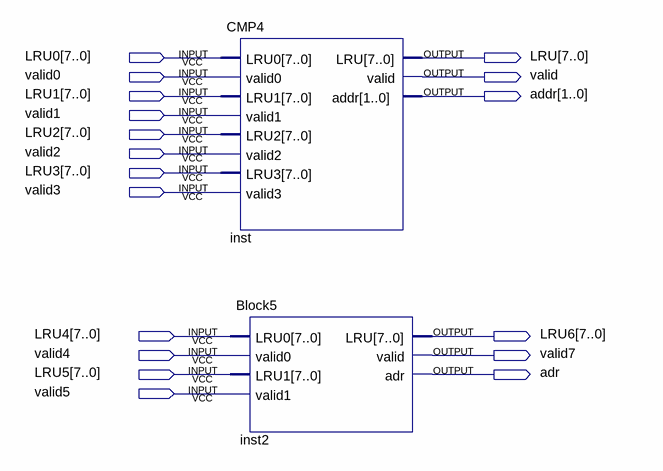
[diagram p0: schematic sheet]
// Quartus schematic CMP4test.bdf as structural Verilog: 2 symbols, 18 pins
module CMP4test (
  input  [7:0] LRU0,
  input  valid0,
  input  [7:0] LRU1,
  input  valid1,
  input  [7:0] LRU2,
  input  valid2,
  input  [7:0] LRU3,
  input  valid3,
  input  [7:0] LRU4,
  input  valid4,
  input  [7:0] LRU5,
  input  valid5,
  output [7:0] LRU,
  output valid,
  output [1:0] addr,
  output [7:0] LRU6,
  output valid7,
  output adr
);

  CMP4 inst (
    .LRU0(LRU0), .valid0(valid0), .LRU1(LRU1), .valid1(valid1), .LRU2(LRU2), .valid2(valid2), .LRU3(LRU3),
    .valid3(valid3), .LRU(LRU), .valid(valid), .addr(addr));
  Block5 inst2 (.LRU0(LRU4), .valid0(valid4), .LRU1(LRU5), .valid1(valid5), .LRU(LRU6), .valid(valid7), .adr(adr));
endmodule
